# EAGLE design foot (EAGLE 7.5.0)
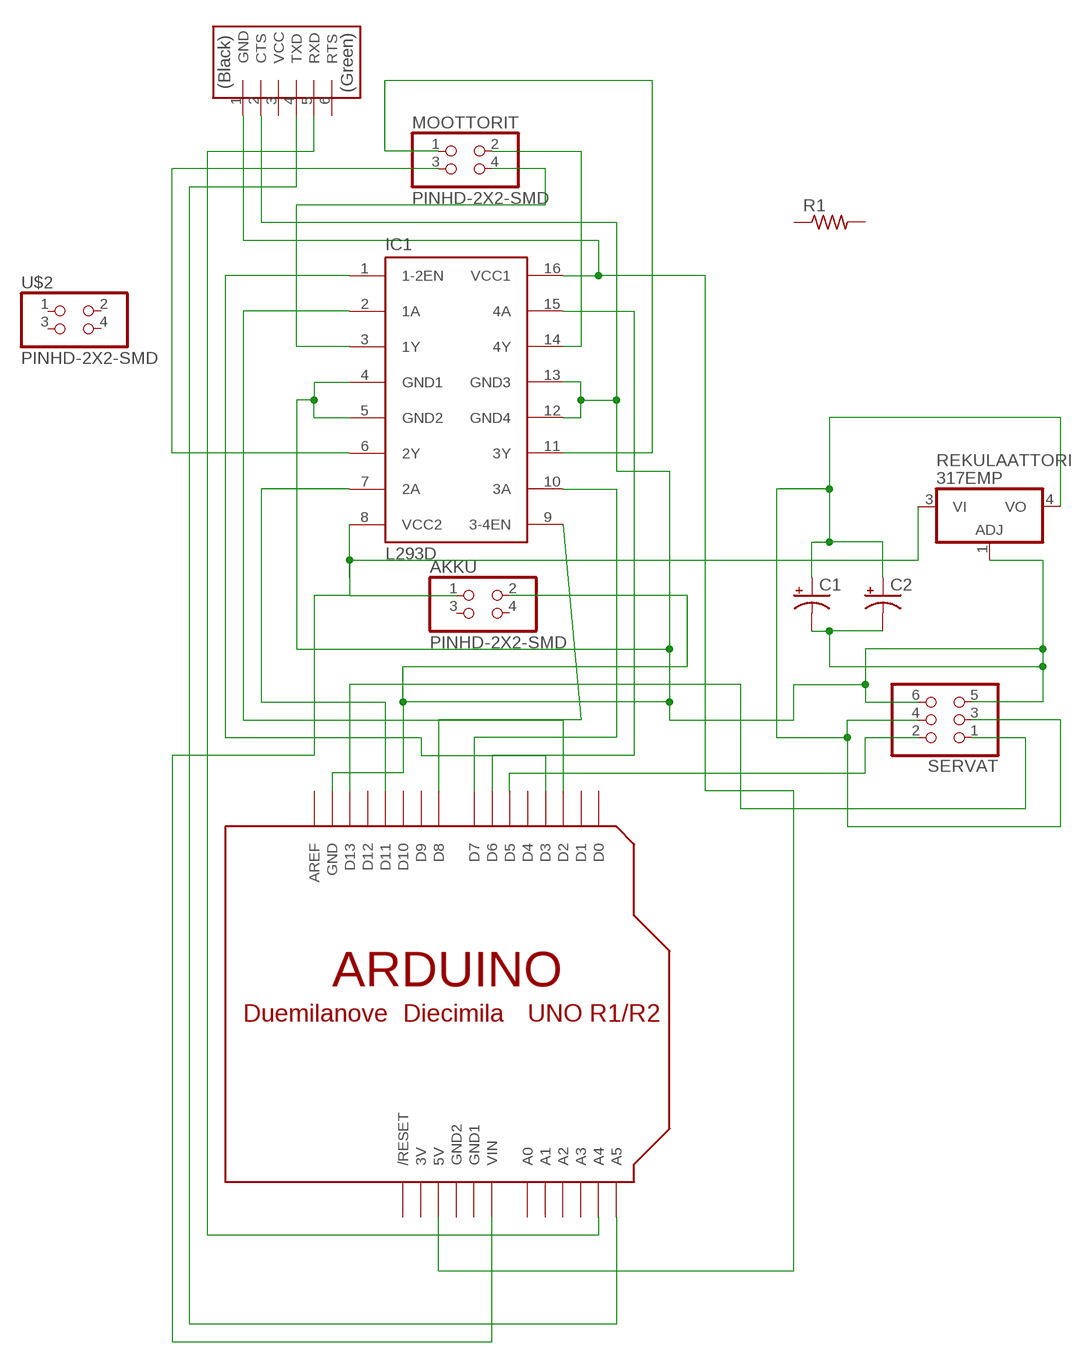
[diagram p0: schematic, sheet 1]

## Parts
AKKU  PINHD-2X2-SMD  [2X02SMD]
C1  CPOL-USE/7260-38W  [E/7260-38W]
C2  CPOL-USE/7260-38W  [E/7260-38W]
IC1  L293D  [DIL16]
MOOTTORIT  PINHD-2X2-SMD  [2X02SMD]
R1  RES-US1206FAB  [R1206FAB]
REKULAATTORI  317EMP  [SOT223]
SERVAT  PINHD-2X3-SMD  [2X03SMD]
U$1  ARDUINO-BPLACE  [ARDUINO-BPLACE]
U$2  PINHD-2X2-SMD  [2X02SMD]
U$4  FTDI-SMD-HEADER  [1X06SMD]

## Nets
N$1: SERVAT.1 U$1.D13
N$2: IC1.10(3A) U$1.D7
N$3: IC1.15(4A) U$1.D6
N$4: AKKU.1 IC1.8(VCC2) REKULAATTORI.3(VI) U$1.VIN
N$5: IC1.14(4Y) MOOTTORIT.2
N$6: IC1.11(3Y) MOOTTORIT.1
N$7: IC1.6(2Y) MOOTTORIT.3
N$8: AKKU.2 C1.- C2.- IC1.4(GND1) IC1.5(GND2) IC1.12(GND4) IC1.13(GND3) REKULAATTORI.1(ADJ) SERVAT.5 SERVAT.6 U$1.GND U$4.2(CTS)
N$9: SERVAT.2 U$1.D5
N$10: IC1.1(1-2EN) U$1.D3
N$11: IC1.2(1A) U$1.D2
N$12: IC1.7(2A) U$1.D11
N$13: U$1.A5 U$4.4(TXD)
N$14: U$1.A4 U$4.5(RXD)
N$15: C1.+ C2.+ REKULAATTORI.4(VO) SERVAT.3 SERVAT.4
N$16: IC1.9(3-4EN) U$1.D8
N$17: IC1.3(1Y) MOOTTORIT.4
N$19: IC1.16(VCC1) U$1.5V U$4.1(GND)
Unconnected: AKKU.3 AKKU.4 R1.1 R1.2 U$1.A0 U$1.A1 U$1.A2 U$1.A3 U$1.AREF U$1.D0 U$1.D1 U$1.D4 U$1.D9 U$1.D10 U$1.D12 U$1.RESET(/RESET) U$2.1 U$2.2 U$2.3 U$2.4 U$4.3(VCC) U$4.6(RTS)

## Power pins joined to a net without a drawn wire
3V: U$1.3V
GND1: U$1.GND1
GND2: U$1.GND2

## Library data of the parts
AKKU MOOTTORIT U$2 = kesäseteli kirjasto:PINHD-2X2-SMD
C1 C2 = kesäseteli kirjasto:CPOL-US: POLARIZED CAPACITOR, American symbol
IC1 = kesäseteli kirjasto:L293D: PUSH-PULL 4 CHANNEL DRIVER; MPN: L293D; OC_FARNELL: 9589619; OC_NEWARK: 56P8249
R1 = fab:RES-US: Resistor (US Symbol) Variants with postfix FAB are widened to allow the routing of internal traces
REKULAATTORI = kesäseteli kirjasto:*317: Positive VOLTAGE REGULATOR
SERVAT = kesäseteli kirjasto:PINHD-2X3-SMD: PIN HEADER
U$1 = kesäseteli kirjasto:ARDUINO: Arduino Diecimila/Duemilanove Make a shield with ease, this package has all the named pins as well as the two mounting drill holes and an outline of the USB and DC power connector. The outline is on the DIMENSION layer, so if your board house uses it they will cut the outline to match. http://www.ladyada.net/library/pcb/eaglelibrary.html
U$4 = kesäseteli kirjasto:FTDI-SMD-HEADER

## Board
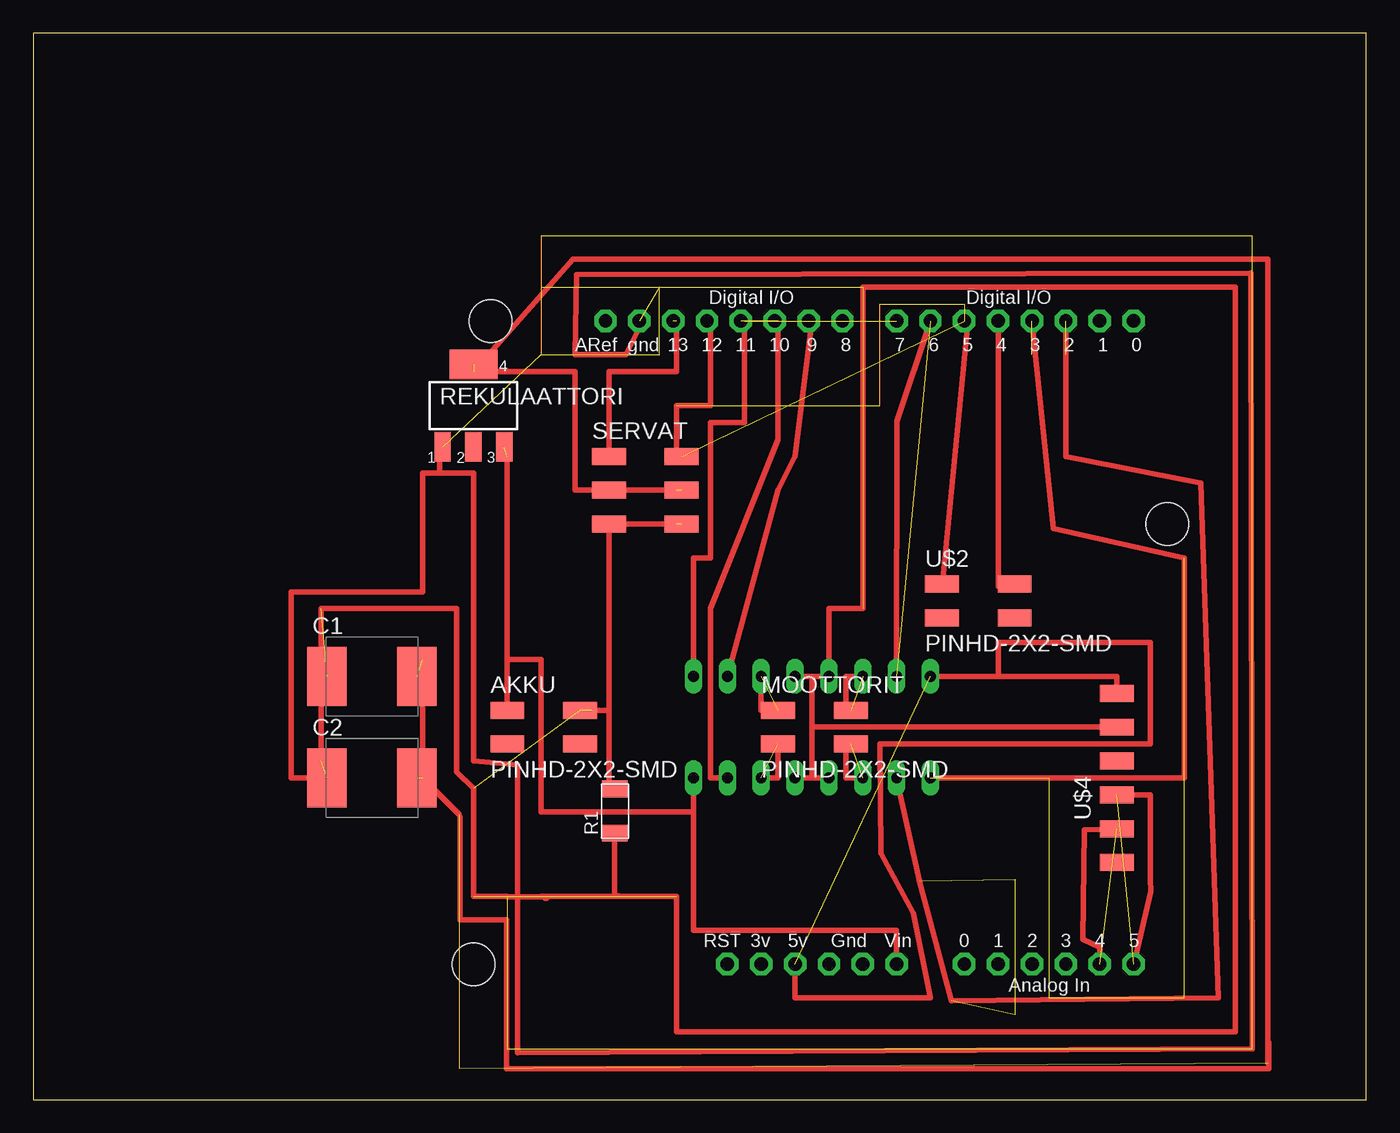
[diagram p1: board, top side]
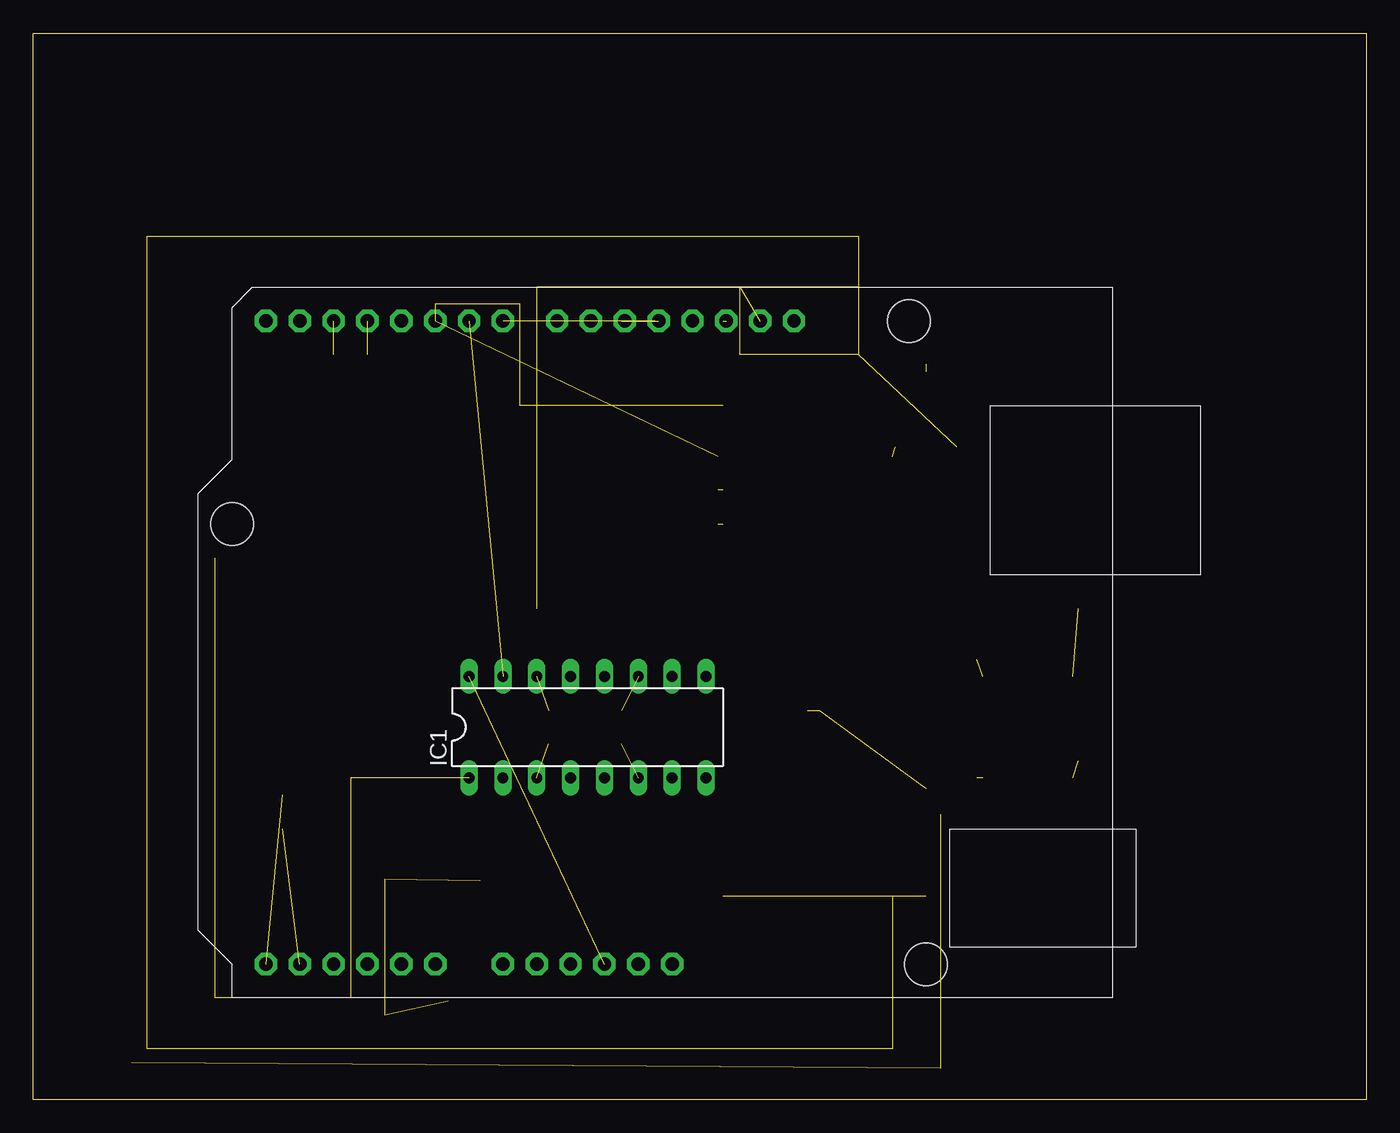
[diagram p2: board, bottom side, seen from below]

Size 100 x 80 mm. Coordinates in mm from the lower left corner, seen from the top.
Outline: 0,0 100,0 100,80 0,80 0,0
Copper layers (1*16): Top 0.035mm / dielectric 1.5mm / Bottom 0.035mm
Design rules "default": minimum track width 10mil, minimum drill 24mil, track to track 8mil, track to pad 8mil, pad to pad 8mil, via to via 8mil, smd to smd 8mil, copper to edge 40mil, drill to drill 8mil, minimum pad ring 10mil, minimum via ring 8mil, stop-mask expansion 4mil, vias tented up to drill 0mil, thermal gap 10mil

### Footprints (pad centres in the part's own frame; a part is rotated, then mirrored left to right if it is on the bottom)
2X02SMD = smd 2.54 x 1.27: 1 -2.54,1.27; 2 2.92,1.27; 3 -2.54,-1.27; 4 2.92,-1.27
E/7260-38W = smd 2.95 x 4.4: + 3.375,0; - -3.375,0
DIL16 = drill 0.813 long: 1 -8.89,-3.81; 2 -6.35,-3.81; 3 -3.81,-3.81; 4 -1.27,-3.81; 5 1.27,-3.81; 6 3.81,-3.81; 7 6.35,-3.81; 8 8.89,-3.81; 9 8.89,3.81; 10 6.35,3.81; 11 3.81,3.81; 12 1.27,3.81; 13 -1.27,3.81; 14 -3.81,3.81; 15 -6.35,3.81; 16 -8.89,3.81
R1206FAB = smd 1.27 x 1.905: 1 -1.651,0; 2 1.651,0
SOT223 = smd 1.219 x 2.235: 1 -2.311,-3.099; 2 0,-3.099; 3 2.311,-3.099 | smd 3.6 x 2.2: 4 0,3.099
2X03SMD = smd 2.54 x 1.27: 1 -2.54,2.54; 2 2.92,2.54; 3 -2.54,0; 4 2.92,0; 5 -2.54,-2.54; 6 2.92,-2.54
ARDUINO-BPLACE = drill 1 pad 1.676 octagon: 3V 35.56,2.54; 5V 38.1,2.54; A0 50.8,2.54; A1 53.34,2.54; A2 55.88,2.54; A3 58.42,2.54; A4 60.96,2.54; A5 63.5,2.54; AREF 23.876,50.8; D0 63.5,50.8; D1 60.96,50.8; D2 58.42,50.8; D3 55.88,50.8; D4 53.34,50.8; D5 50.8,50.8; D6 48.26,50.8; D7 45.72,50.8; D8 41.656,50.8; D9 39.116,50.8; D10 36.576,50.8; D11 34.036,50.8; D12 31.496,50.8; D13 28.956,50.8; GND 26.416,50.8; GND1 43.18,2.54; GND2 40.64,2.54; RESET 33.02,2.54; VIN 45.72,2.54 | hole 3.2: 15.24,50.8; 66.04,35.56; 13.97,2.54
1X06SMD = smd 2.54 x 1.27: 1 0,6.35; 2 0,3.81; 3 0,1.27; 4 0,-1.27; 5 0,-3.81; 6 0,-6.35

### Placement (x,y rotation side)
AKKU  38.1,27.94 0 top
C1  25.4,31.75 0 top
C2  25.4,24.13 0 top
IC1  58.42,27.94 0 bottom
MOOTTORIT  58.42,27.94 0 top
R1  43.63,21.64 90 top
REKULAATTORI  33.02,52.07 0 top
SERVAT  45.72,45.72 0 top
U$1  19.05,7.62 0 top
U$2  70.7,37.4 0 top
U$4  81.28,24.13 0 top

### Tracks (layer width: path | path; a pad name or v marks a point on that pad's centre or on a via)
N$1  (1 unrouted)
  Top 0.406: SERVAT.1 43.18,54.61 48.26,54.61 48.26,58.42
N$2  (1 unrouted)
  Top 0.406: IC1.10 55.88,45.72 57.15,48.26 58.42,58.42
N$3  (1 unrouted)
  Top 0.406: IC1.15 64.81,50.9 U$1.D6
N$4  (1 unrouted)
  Top 0.406: 35.56,48.26 35.56,33.02 | 35.56,33.02 AKKU.1 | 35.56,33.02 38.1,33.02 38.1,21.59 49.53,21.59 IC1.8 49.53,12.7 64.77,12.7 U$1.VIN
N$5  (1 unrouted)
  Top 0.406: IC1.14 60.96,31.75 60.96,29.21
N$6  (1 unrouted)
  Top 0.406: MOOTTORIT.1 54.61,29.21 IC1.11
N$7  (1 unrouted)
  Top 0.406: IC1.6 55.88,24.13 MOOTTORIT.3
N$8  (20 unrouted)
  Top 0.406: 21.59,25.4 21.59,36.83 31.75,36.83 31.75,24.6 33.02,23.33 33.02,15.24 35.56,15.24 | IC1.5 58.42,24.13 | IC1.4 58.42,24.13 | 58.42,24.13 58.42,27.94 | 58.42,27.94 58.42,31.75 | 58.42,31.75 IC1.13 59.69,36.83 62.23,36.83 62.23,60.96 90.17,60.96 90.17,5.08 48.26,5.08 48.26,15.24 38.1,15.24 | IC1.12 58.42,31.75 | 58.42,27.94 U$4.2 | 41.91,29.21 43.18,29.21 SERVAT.5 48.26,43.18
N$9  (5 unrouted)
  Top 0.406: 48.26,48.26 48.26,52.07 50.8,52.07 50.8,58.42
N$10  (6 unrouted)
  Top 0.406: U$1.D3 76.53,42.84 86.36,40.64 86.36,24.13 IC1.1
N$11  (5 unrouted)
  Top 0.406: IC1.2 66.47,16.41 66.44,16.51 68.88,7.42 88.9,7.62 87.6,46.26 77.47,48.26 U$1.D2
N$12  (1 unrouted)
  Top 0.406: IC1.7 50.8,24.13 50.8,36.83 55.88,49.53 55.88,58.42
N$13  (1 unrouted)
  Top 0.406: U$1.A5 83.85,15.61 83.82,16.51 83.82,22.86 U$4.4
N$14  (1 unrouted)
  Top 0.406: U$4.5 78.84,20.22 78.74,12.03 80.01,11.43 U$1.A4
N$15  (6 unrouted)
  Top 0.406: 29.21,33.02 29.21,24.13 31.95,21.39 | 92.61,2.74 92.61,63.07 40.5,63.07 33.02,54.61 40.64,54.61 40.64,45.72 SERVAT.3 48.26,45.72
N$16  (1 unrouted)
  Top 0.406: IC1.9 49.53,40.64 50.8,40.64 50.8,50.8 53.34,50.8 53.34,58.42
N$17  (1 unrouted)
  Top 0.406: IC1.3 60.96,24.13 60.96,26.67
N$18
  Top 0.406: 35.6,15.2 38.4,15.2 38.4,15.1 38.5,15.1 38.5,15.2
N$19  (1 unrouted)
  Top 0.406: IC1.16 72.39,31.75 | 72.39,31.75 81.28,31.75 U$4.1 | U$1.5V 57.15,7.62 67.31,7.62 66.04,13.97 63.6,18.47 63.5,26.67 83.82,26.67 83.82,34.29 72.39,34.29 72.39,31.75
N$20
  Top 0.406: 21.59,24.13 19.35,24.13 19.35,38.1 29.21,38.1 29.21,46.99 30.48,46.99 | 30.48,49.53 30.48,46.99 | 30.48,46.99 33.02,46.99 33.02,25.4 36.33,25.1 36.33,3.51 91.44,3.81 91.34,62 40.74,61.9 40.64,55.88 44.45,55.88 45.72,58.42
N$21
  Top 0.406: 43.9,15.3 43.6,15.3 43.6,20.2
N$22
  Top 0.406: 43.7,23.4 43.2,23.4 43.2,29.1 43.2,29.2
N$23
  Top 0.406: 73.2,38.5 72.4,38.5 72.4,58.5 72.5,58.5 72.5,58.7
N$24
  Top 0.406: 69.9,58.3 70.1,58.3 68.2,38.7
N$25
  Top 0.406: 32,21.2 32,13.5 35.5,13.5 35.5,2.3 92.7,2.3 92.7,4.3